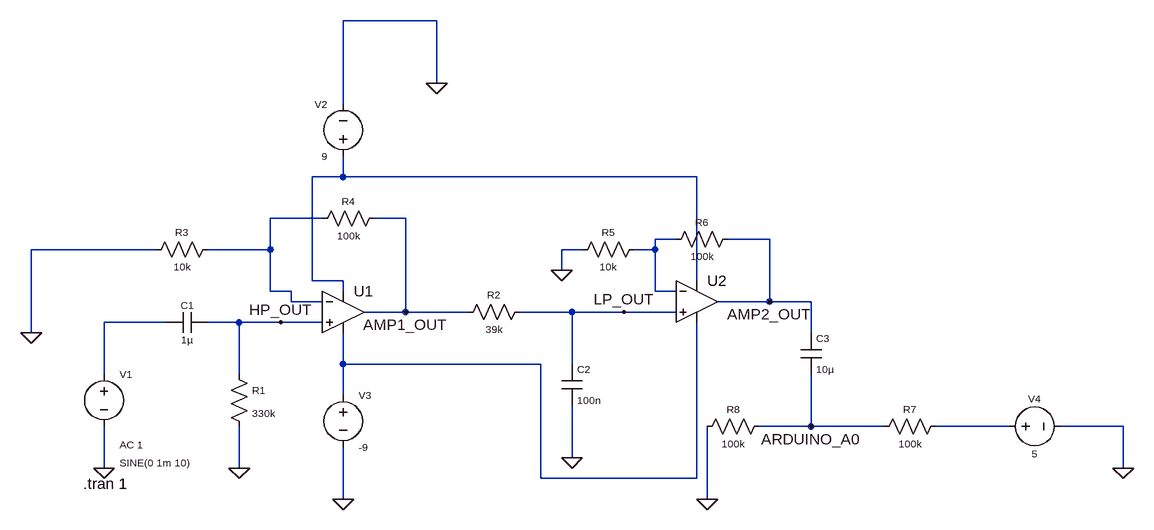
[diagram p0: schematic eeg_frontend_v1_opamp_hp-lp.asc]
eeg_frontend_v1_opamp_hp-lp.asc, the LTspice schematic file:
Version 4.1
SHEET 1 1540 680
WIRE 464 -416 320 -416
WIRE 464 -320 464 -416
WIRE 320 -288 320 -416
WIRE 320 -176 320 -208
WIRE 320 -176 272 -176
WIRE 864 -176 320 -176
WIRE 288 -112 208 -112
WIRE 416 -112 368 -112
WIRE 832 -80 800 -80
WIRE 976 -80 912 -80
WIRE 32 -64 -160 -64
WIRE 208 -64 208 -112
WIRE 208 -64 112 -64
WIRE 688 -64 656 -64
WIRE 800 -64 800 -80
WIRE 800 -64 768 -64
WIRE 656 -32 656 -64
WIRE 272 -16 272 -176
WIRE 320 -16 272 -16
WIRE 864 -16 864 -176
WIRE 208 0 208 -64
WIRE 240 0 208 0
WIRE 320 0 320 -16
WIRE 800 0 800 -64
WIRE 832 0 800 0
WIRE 240 16 240 0
WIRE 288 16 240 16
WIRE 976 16 976 -80
WIRE 976 16 896 16
WIRE 1040 16 976 16
WIRE 416 32 416 -112
WIRE 416 32 352 32
WIRE 512 32 416 32
WIRE 672 32 592 32
WIRE 752 32 672 32
WIRE 832 32 752 32
WIRE 48 48 -48 48
WIRE 160 48 112 48
WIRE 224 48 160 48
WIRE 288 48 224 48
WIRE -160 64 -160 -64
WIRE 1040 64 1040 16
WIRE 320 112 320 64
WIRE 624 112 320 112
WIRE 672 112 672 32
WIRE -48 128 -48 48
WIRE 160 128 160 48
WIRE 320 160 320 112
WIRE 1040 208 1040 128
WIRE 1040 208 960 208
WIRE 1152 208 1040 208
WIRE 1344 208 1232 208
WIRE 1520 208 1424 208
WIRE 672 256 672 176
WIRE -48 272 -48 208
WIRE 160 272 160 208
WIRE 1520 272 1520 208
WIRE 624 288 624 112
WIRE 864 288 864 48
WIRE 864 288 624 288
WIRE 320 320 320 240
WIRE 880 320 880 208
FLAG 160 272 0
FLAG -48 272 0
FLAG 672 256 0
FLAG 464 -320 0
FLAG 320 320 0
FLAG 656 -32 0
FLAG 880 320 0
FLAG 1520 272 0
FLAG -160 64 0
FLAG 1040 208 ARDUINO_A0
FLAG 976 16 AMP2_OUT
FLAG 752 32 LP_OUT
FLAG 416 32 AMP1_OUT
FLAG 224 48 HP_OUT
SYMBOL cap 112 32 R90
WINDOW 0 0 32 VBottom 1
WINDOW 3 32 32 VTop 1
SYMATTR InstName C1
SYMATTR Value 1µ
SYMBOL res 144 112 R0
WINDOW 0 36 40 Left 1
WINDOW 3 36 76 Left 1
SYMATTR InstName R1
SYMATTR Value 330k
SYMBOL voltage -48 112 R0
WINDOW 3 24 152 Left 1
WINDOW 123 24 124 Left 1
WINDOW 39 0 0 Left 0
WINDOW 0 24 16 Left 1
SYMATTR Value SINE(0 1m 10)
SYMATTR Value2 AC 1
SYMATTR InstName V1
SYMBOL res 608 16 R90
WINDOW 0 0 56 VBottom 1
WINDOW 3 32 56 VTop 1
SYMATTR InstName R2
SYMATTR Value 39k
SYMBOL cap 656 112 R0
WINDOW 0 24 8 Left 1
WINDOW 3 24 56 Left 1
SYMATTR InstName C2
SYMATTR Value 100n
SYMBOL OpAmps\\UniversalOpAmp2 320 32 R0
SYMATTR InstName U1
SYMBOL voltage 320 -192 R180
WINDOW 0 24 96 Left 1
WINDOW 3 24 16 Left 1
WINDOW 123 0 0 Left 0
WINDOW 39 0 0 Left 0
SYMATTR InstName V2
SYMATTR Value 9
SYMBOL voltage 320 144 R0
WINDOW 123 0 0 Left 0
WINDOW 39 0 0 Left 0
WINDOW 0 24 16 Left 1
WINDOW 3 24 96 Left 1
SYMATTR InstName V3
SYMATTR Value -9
SYMBOL res 128 -80 R90
WINDOW 0 0 56 VBottom 1
WINDOW 3 32 56 VTop 1
SYMATTR InstName R3
SYMATTR Value 10k
SYMBOL res 384 -128 R90
WINDOW 0 0 56 VBottom 1
WINDOW 3 32 56 VTop 1
SYMATTR InstName R4
SYMATTR Value 100k
SYMBOL OpAmps\\UniversalOpAmp2 864 16 R0
SYMATTR InstName U2
SYMBOL res 784 -80 R90
WINDOW 0 0 56 VBottom 1
WINDOW 3 32 56 VTop 1
SYMATTR InstName R5
SYMATTR Value 10k
SYMBOL res 928 -96 R90
WINDOW 0 0 56 VBottom 1
WINDOW 3 32 56 VTop 1
SYMATTR InstName R6
SYMATTR Value 100k
SYMBOL cap 1024 64 R0
WINDOW 0 24 8 Left 1
WINDOW 3 24 56 Left 1
SYMATTR InstName C3
SYMATTR Value 10µ
SYMBOL res 1248 192 R90
WINDOW 0 0 56 VBottom 1
WINDOW 3 32 56 VTop 1
SYMATTR InstName R7
SYMATTR Value 100k
SYMBOL res 976 192 R90
WINDOW 0 0 56 VBottom 1
WINDOW 3 32 56 VTop 1
SYMATTR InstName R8
SYMATTR Value 100k
SYMBOL voltage 1328 208 R270
WINDOW 0 32 56 VTop 1
WINDOW 3 -32 56 VBottom 1
WINDOW 123 0 0 Left 0
WINDOW 39 0 0 Left 0
SYMATTR InstName V4
SYMATTR Value 5
TEXT -80 296 Left 2 !.tran 1

The netlist it stands for:
* eeg_frontend_v1_opamp_hp-lp.asc
C1 HP_OUT N004 1µ
R1 HP_OUT 0 330k
V1 N004 0 SINE(0 1m 10) AC 1
R2 LP_OUT AMP1_OUT 39k
C2 LP_OUT 0 100n
X§U1 HP_OUT N002 N001 N005 AMP1_OUT level2 Avol=1Meg GBW=10Meg Slew=10Meg Ilimit=25m Rail=0 Vos=0 En=0 Enk=0 In=0 Ink=0 Rin=500Meg  ; pins In+ In- V+ V- OUT
V2 N001 0 9
V3 N005 0 -9
R3 N002 0 10k
R4 AMP1_OUT N002 100k
X§U2 LP_OUT N003 N001 N005 AMP2_OUT level2 Avol=1Meg GBW=10Meg Slew=10Meg Ilimit=25m Rail=0 Vos=0 En=0 Enk=0 In=0 Ink=0 Rin=500Meg  ; pins In+ In- V+ V- OUT
R5 N003 0 10k
R6 AMP2_OUT N003 100k
C3 AMP2_OUT ARDUINO_A0 10µ
R7 N006 ARDUINO_A0 100k
R8 ARDUINO_A0 0 100k
V4 N006 0 5
.tran 1
.lib UniversalOpAmp2.lib
.backanno
.end